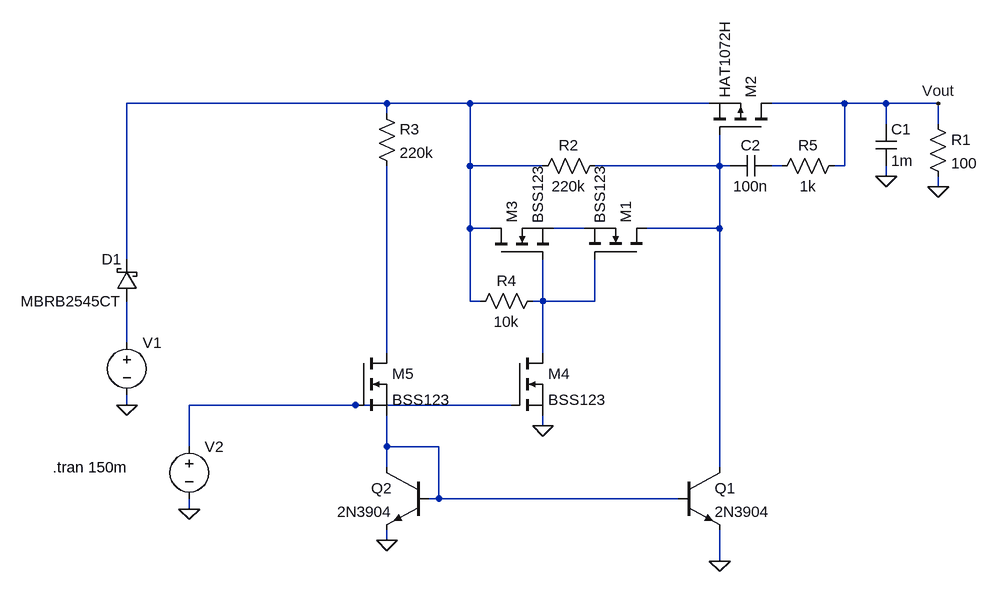
[diagram p0: schematic surge.asc]
surge.asc, the LTspice schematic file:
Version 4
SHEET 1 1060 680
WIRE 144 -240 -256 -240
WIRE 272 -240 144 -240
WIRE 640 -240 272 -240
WIRE 848 -240 736 -240
WIRE 912 -240 848 -240
WIRE 992 -240 912 -240
WIRE 144 -224 144 -240
WIRE 912 -208 912 -240
WIRE 992 -208 992 -240
WIRE 272 -144 272 -240
WIRE 384 -144 272 -144
WIRE 656 -144 656 -192
WIRE 656 -144 464 -144
WIRE 672 -144 656 -144
WIRE 752 -144 736 -144
WIRE 848 -144 848 -240
WIRE 848 -144 832 -144
WIRE 912 -128 912 -144
WIRE 992 -112 992 -128
WIRE 272 -48 272 -144
WIRE 304 -48 272 -48
WIRE 448 -48 400 -48
WIRE 656 -48 656 -144
WIRE 656 -48 544 -48
WIRE -256 0 -256 -240
WIRE 272 64 272 -48
WIRE 288 64 272 64
WIRE 384 64 384 0
WIRE 384 64 368 64
WIRE 464 64 464 0
WIRE 464 64 384 64
WIRE -256 128 -256 64
WIRE 144 144 144 -144
WIRE 384 144 384 64
WIRE -256 224 -256 208
WIRE 96 224 -160 224
WIRE 336 224 96 224
WIRE 384 256 384 240
WIRE -160 288 -160 224
WIRE 144 288 144 240
WIRE 224 288 144 288
WIRE 144 320 144 288
WIRE 656 320 656 -48
WIRE 224 368 224 288
WIRE 224 368 208 368
WIRE 592 368 224 368
WIRE -160 384 -160 368
WIRE 144 432 144 416
WIRE 656 464 656 416
FLAG -160 384 0
FLAG -256 224 0
FLAG 912 -128 0
FLAG 992 -112 0
FLAG 992 -240 Vout
FLAG 144 432 0
FLAG 384 256 0
FLAG 656 464 0
SYMBOL voltage -256 112 R0
WINDOW 3 24 96 Invisible 2
WINDOW 123 0 0 Left 2
WINDOW 39 0 0 Left 2
SYMATTR InstName V1
SYMATTR Value PWL(0 0 +100u 24 100m 24 +100u 0)
SYMBOL voltage -160 272 R0
WINDOW 3 24 96 Invisible 2
WINDOW 123 0 0 Left 2
WINDOW 39 0 0 Left 2
SYMATTR InstName V2
SYMATTR Value PWL(0 0 1m 0 +10u 5 80m 5 +10u 0)
SYMBOL pmos 736 -192 M270
SYMATTR InstName M2
SYMATTR Value HAT1072H
SYMBOL res 976 -224 R0
SYMATTR InstName R1
SYMATTR Value 100
SYMBOL cap 896 -208 R0
SYMATTR InstName C1
SYMATTR Value 1m
SYMBOL res 480 -160 R90
WINDOW 0 0 56 VBottom 2
WINDOW 3 32 56 VTop 2
SYMATTR InstName R2
SYMATTR Value 220k
SYMBOL cap 736 -160 R90
WINDOW 0 0 32 VBottom 2
WINDOW 3 32 32 VTop 2
SYMATTR InstName C2
SYMATTR Value 100n
SYMBOL res 128 -240 R0
SYMATTR InstName R3
SYMATTR Value 220k
SYMBOL npn 208 320 M0
SYMATTR InstName Q2
SYMATTR Value 2N3904
SYMBOL npn 592 320 R0
SYMATTR InstName Q1
SYMATTR Value 2N3904
SYMBOL nmos 304 0 R270
SYMATTR InstName M3
SYMATTR Value BSS123
SYMBOL res 384 48 R90
WINDOW 0 0 56 VBottom 2
WINDOW 3 32 56 VTop 2
SYMATTR InstName R4
SYMATTR Value 10k
SYMBOL nmos 336 144 R0
SYMATTR InstName M4
SYMATTR Value BSS123
SYMBOL nmos 96 144 R0
SYMATTR InstName M5
SYMATTR Value BSS123
SYMBOL schottky -240 64 R180
WINDOW 0 24 64 Left 2
WINDOW 3 24 0 Left 2
SYMATTR InstName D1
SYMATTR Value MBRB2545CT
SYMATTR Description Diode
SYMATTR Type diode
SYMBOL nmos 544 0 M270
SYMATTR InstName M1
SYMATTR Value BSS123
SYMBOL res 848 -160 R90
WINDOW 0 0 56 VBottom 2
WINDOW 3 32 56 VTop 2
SYMATTR InstName R5
SYMATTR Value 1k
TEXT -370 320 Left 2 !.tran 150m

The netlist it stands for:
* surge.asc
V1 N006 0 PWL(0 0 +100u 24 100m 24 +100u 0)
V2 N008 0 PWL(0 0 1m 0 +10u 5 80m 5 +10u 0)
M2 Vout N002 N001 N001 HAT1072H
R1 Vout 0 100
C1 Vout 0 1m
R2 N002 N001 220k
C2 N003 N002 100n
R3 N001 N007 220k
Q2 N009 N009 0 0 2N3904
Q1 N002 N009 0 0 2N3904
M3 N001 N005 N004 N004 BSS123
R4 N005 N001 10k
M4 N005 N008 0 0 BSS123
M5 N007 N008 N009 N009 BSS123
D1 N006 N001 MBRB2545CT
M1 N002 N005 N004 N004 BSS123
R5 Vout N003 1k
.model D D
.lib standard.dio
.model NPN NPN
.model PNP PNP
.lib standard.bjt
.model NMOS NMOS
.model PMOS PMOS
.lib standard.mos
.tran 150m
.backanno
.end